# EAGLE schematic moustache_board (EAGLE 7.7.0)
SCALE: 1:1; SCHEMATIC_NAME: RECO0.16.018.01.00.00.E3; STUDENT: D. Palamarčuks; THESIS_SUPERVISOR: I. Galkins

## Sheet 1 of 2
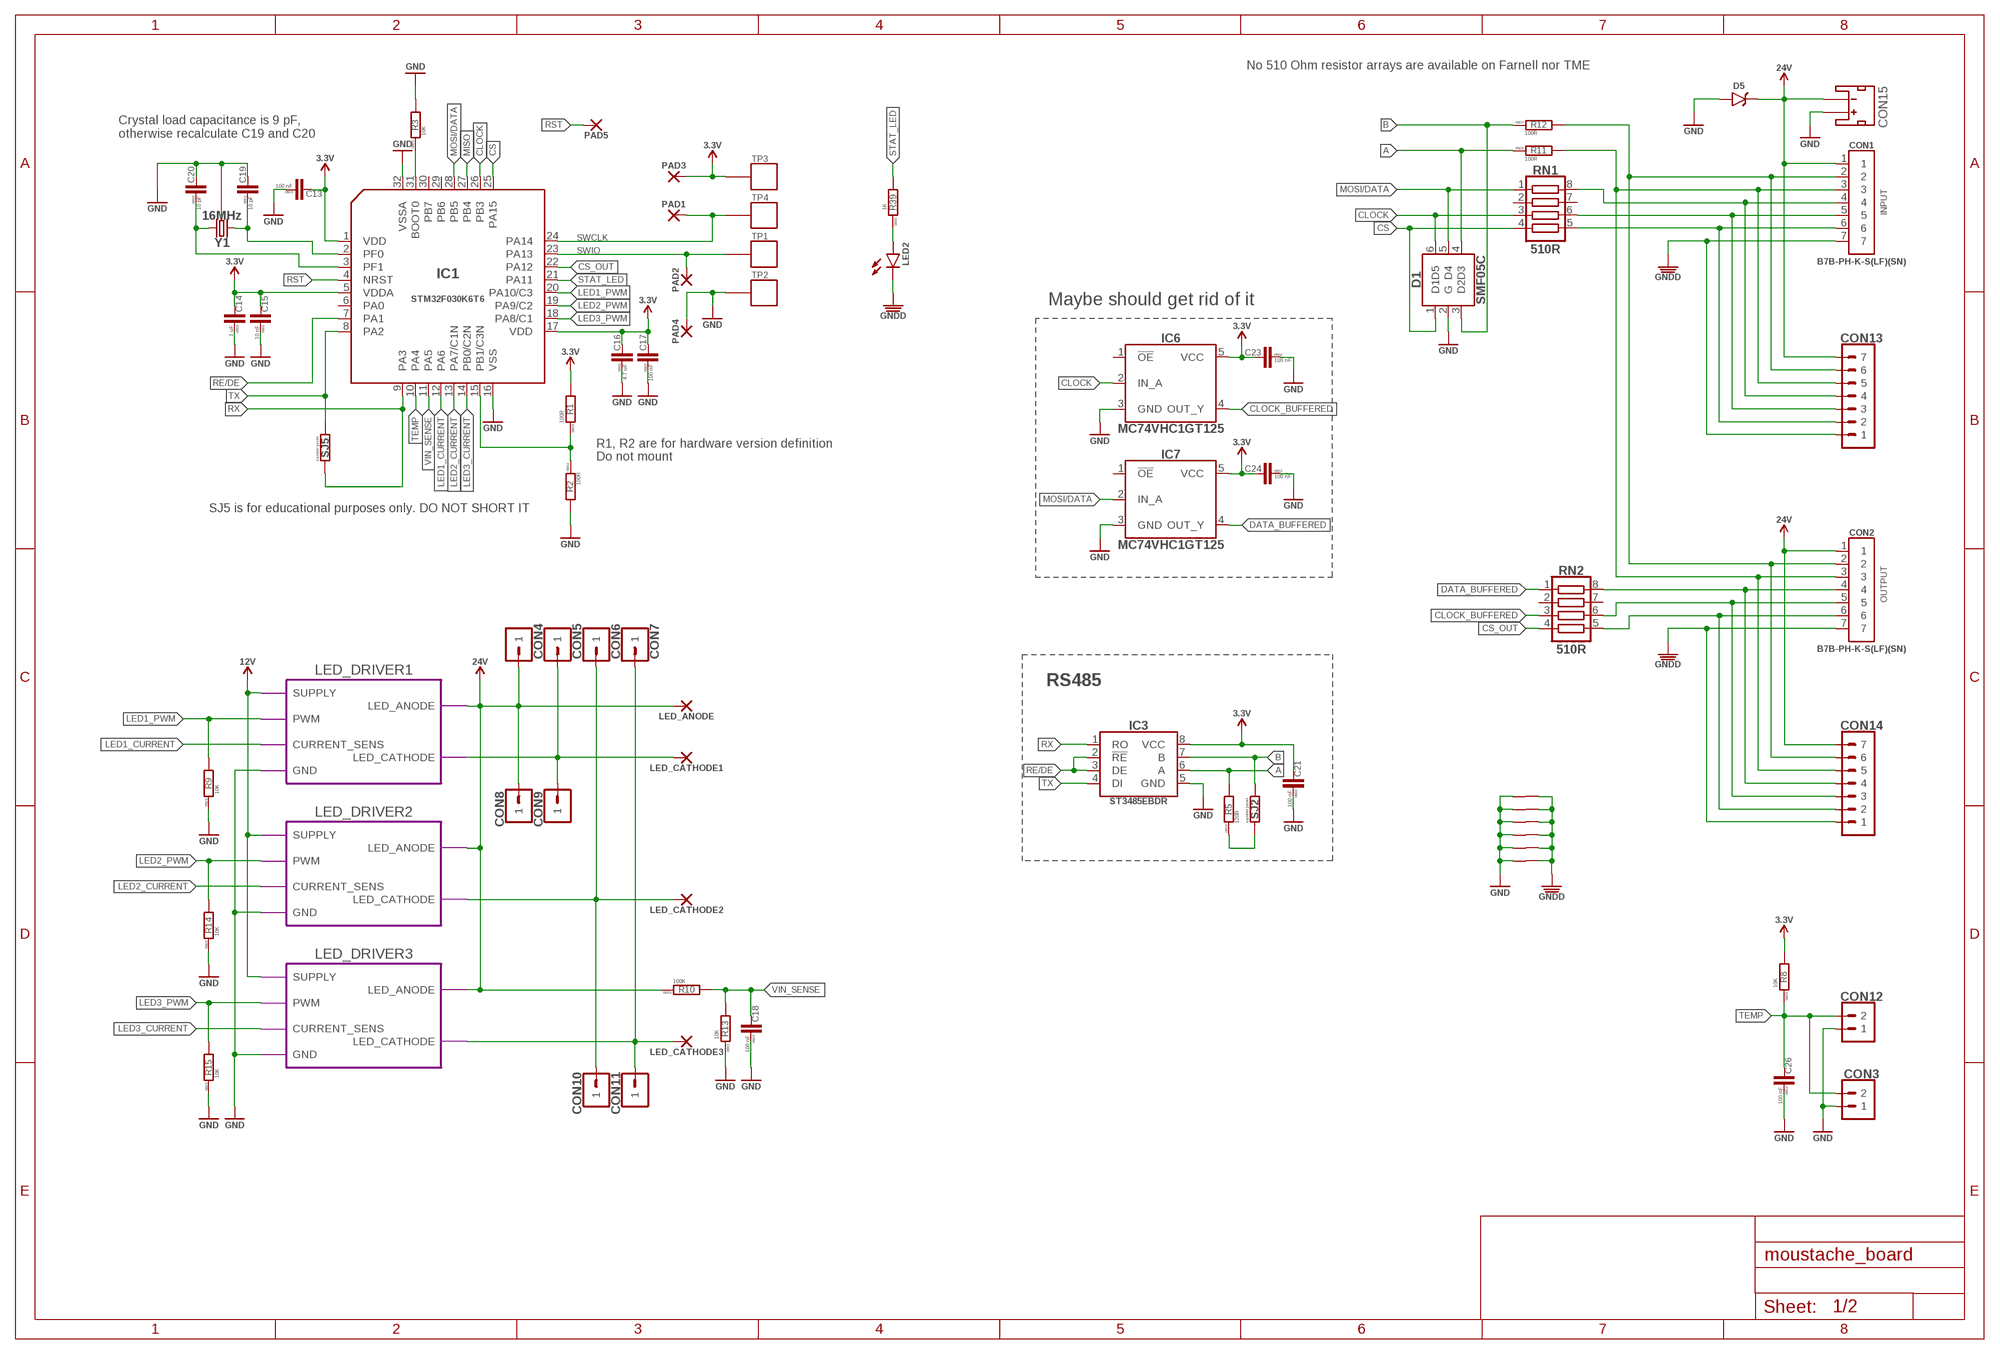
[diagram p0: schematic, sheet 1]

### Parts
C13  100 nF  C-0603  [C0603]
C14  1 uF  C-0603  [C0603]
C15  10 nF  C-0603  [C0603]
C16  4.7 uF  C-0603  [C0603]
C17  100 nF  C-0603  [C0603]
C18  100 nF  C-0603  [C0603]
C19  10 pF  C-0603  [C0603]
C20  10 pF  C-0603  [C0603]
C21  100 nF  C-0603  [C0603]
C23  100 nF  C-0603  [C0603]
C24  100 nF  C-0603  [C0603]
C26  100 nF  C-0603  [C0603]
CON1  B7B-PH-K-S-SIDE  [B7B-PH-K-S_SIDE]
CON2  B7B-PH-K-S-SIDE  [B7B-PH-K-S_SIDE]
CON3  PINHEAD_1X02-2.54  [1X02-PTH-2.54]
CON4  PINHEAD_1X01-2.54  [1X01-PTH-2.54]
CON5  PINHEAD_1X01-2.54  [1X01-PTH-2.54]
CON6  PINHEAD_1X01-2.54  [1X01-PTH-2.54]
CON7  PINHEAD_1X01-2.54  [1X01-PTH-2.54]
CON8  PINHEAD_1X01-2.54  [1X01-PTH-2.54]
CON9  PINHEAD_1X01-2.54  [1X01-PTH-2.54]
CON10  PINHEAD_1X01-2.54  [1X01-PTH-2.54]
CON11  PINHEAD_1X01-2.54  [1X01-PTH-2.54]
CON12  PINHEAD_1X02-2.54  [1X02-PTH-2.54]
CON13  PINHEAD_1X07-2  [1X07-PTH-2]
CON14  PINHEAD_1X07-2  [1X07-PTH-2]
CON15  B2B-PH-K-S  [B2B-PH-K-S_SIDE_MOUNT]
D1  SMF05C  [SC70_6L]
D5  TVS_DIODE-SMB  [SMB]
IC1  STM32F030K6TX-LQFP32(7X7)  [LQFP32-7X7]
IC3  ST3485SOIC8  [SOIC8]
IC6  MC74VHC1GT125  [SOT23-5]
IC7  MC74VHC1GT125  [SOT23-5]
LED2  LED-0603  [LED0603]
LED_ANODE  WIREPADSMD2.5-1.8  [PAD-2.5-1.8]
LED_CATHODE1  WIREPADSMD2.5-1.8  [PAD-2.5-1.8]
LED_CATHODE2  WIREPADSMD2.5-1.8  [PAD-2.5-1.8]
LED_CATHODE3  WIREPADSMD2.5-1.8  [PAD-2.5-1.8]
PAD1  WIREPADSMD2.5-1.8  [PAD-2.5-1.8]
PAD2  WIREPADSMD2.5-1.8  [PAD-2.5-1.8]
PAD3  WIREPADSMD2.5-1.8  [PAD-2.5-1.8]
PAD4  WIREPADSMD2.5-1.8  [PAD-2.5-1.8]
PAD5  WIREPADSMD2.5-1.8  [PAD-2.5-1.8]
R1  100R  R-0603  [R0603]
R2  100R  R-0603  [R0603]
R3  10K  R-0603  [R0603]
R5  120R  R-0603  [R0603]
R8  10K  R-0603  [R0603]
R9  10K  R-0603  [R0603]
R10  100K  R-0603  [R0603]
R11  100R  R-0603  [R0603]
R12  100R  R-0603  [R0603]
R13  10K  R-0603  [R0603]
R14  10K  R-0603  [R0603]
R15  10K  R-0603  [R0603]
R39  1K  R-0603  [R0603]
RN1  510R  RESISTOR_ARRAY  [CAT16-J4]
RN2  510R  RESISTOR_ARRAY  [CAT16-J4]
SJ2  SOLDER_JOINT  [RES_0]
SJ5  SOLDER_JOINT  [RES_0]
TP1  PAD.05  [PAD.05X.05]
TP2  PAD.05  [PAD.05X.05]
TP3  PAD.05  [PAD.05X.05]
TP4  PAD.05  [PAD.05X.05]
U$3  CONNECTION  [CONNECTION]
U$6  CONNECTION  [CONNECTION]
U$7  CONNECTION  [CONNECTION]
U$8  CONNECTION  [CONNECTION]
U$9  CONNECTION  [CONNECTION]
U$10  CONNECTION  [CONNECTION]
Y1  16MHz  CRYSTAL-3.2X2.5-4P  [OSCILLATOR-3.2X2.5]

### Module instances
LED_DRIVER1 = LED_DRIVER (part numbers offset by 100)
LED_DRIVER2 = LED_DRIVER (part numbers offset by 200)
LED_DRIVER3 = LED_DRIVER (part numbers offset by 300)

### Nets
A: D1.4(D3) IC3.6(A) R5.2 R11.1
B: D1.3(D2) IC3.7(B) R12.1 SJ2.1
CLOCK: D1.6(D5) IC1.26(PB3) IC6.2(IN_A) RN1.3
CLOCK_BUFFERED: IC6.4(OUT_Y) RN2.3
CS: D1.1(D1) IC1.25(PA15) RN1.4
CS_OUT: IC1.22(PA12) RN2.4
DATA_BUFFERED: IC7.4(OUT_Y) RN2.1
GND: C13.1 C14.1 C15.1 C16.1 C17.1 C18.1 C19.2 C20.2 C21.1 C23.1 C24.1 C26.1 CON3.1 CON12.1 CON15.1(+) D1.2(G) D5.A IC1.16(VSS) IC1.32(VSSA) IC3.5(GND) IC6.3(GND) IC7.3(GND) PAD4.P$1(P) R2.2 R3.2 R9.1 R13.1 R14.1 R15.1 TP2.P$1 U$3.P$2 U$6.P$2 U$7.P$2 U$8.P$2 U$9.P$2 U$10.P$2 Y1.2(GND) Y1.4(GND) ; port LED_DRIVER1.GND LED_DRIVER3.GND LED_DRIVER2.GND ; also sheet 2
GNDD: CON1.7 CON2.7 CON13.1 CON14.1 LED2.C U$3.P$1 U$6.P$1 U$7.P$1 U$8.P$1 U$9.P$1 U$10.P$1
LED1_CURRENT: IC1.12(PA6) ; port LED_DRIVER1.CURRENT_SENS
LED1_PWM: IC1.20(PA10/C3) R9.2 ; port LED_DRIVER1.PWM
LED2_CURRENT: IC1.13(PA7/C1N) ; port LED_DRIVER2.CURRENT_SENS
LED2_PWM: IC1.19(PA9/C2) R14.2 ; port LED_DRIVER2.PWM
LED3_CURRENT: IC1.14(PB0/C2N) ; port LED_DRIVER3.CURRENT_SENS
LED3_PWM: IC1.18(PA8/C1) R15.2 ; port LED_DRIVER3.PWM
MISO: IC1.27(PB4)
MOSI/DATA: D1.5(D4) IC1.28(PB5) IC7.2(IN_A) RN1.1
N$1: R5.1 SJ2.2
N$3: IC1.15(PB1/C3N) R1.1 R2.1
N$4: C19.1 IC1.2(PF0) Y1.1
N$6: IC1.31(BOOT0) R3.1
N$9: C20.1 IC1.3(PF1) Y1.3
N$10: CON5.1 CON9.1 LED_CATHODE1.P$1(P) ; port LED_DRIVER1.LED_CATHODE
N$11: CON1.4 CON13.4 RN1.8
N$12: CON1.5 CON13.3 RN1.6
N$13: CON1.6 CON13.2 RN1.5
N$14: CON2.4 CON14.4 RN2.8
N$15: CON2.5 CON14.3 RN2.6
N$19: CON2.6 CON14.2 RN2.5
N$21: CON6.1 CON10.1 LED_CATHODE2.P$1(P) ; port LED_DRIVER2.LED_CATHODE
N$22: LED2.A R39.1
N$23: CON7.1 CON11.1 LED_CATHODE3.P$1(P) ; port LED_DRIVER3.LED_CATHODE
RE/DE: IC1.7(PA1) IC3.2(!RE) IC3.3(DE)
RS485_A: CON1.2 CON2.2 CON13.6 CON14.6 R12.2
RS485_B: CON1.3 CON2.3 CON13.5 CON14.5 R11.2
RST: IC1.4(NRST) PAD5.P$1(P)
RX: IC1.9(PA3) IC3.1(RO) SJ5.2
STAT_LED: IC1.21(PA11) R39.2
SWCLK: IC1.24(PA14) PAD1.P$1(P) TP4.P$1
SWIO: IC1.23(PA13) PAD2.P$1(P) TP1.P$1
TEMP: C26.2 CON3.2 CON12.2 IC1.10(PA4) R8.1
TX: IC1.8(PA2) IC3.4(DI) SJ5.1
VDD_3V3: C13.2 C14.2 C15.2 C16.2 C17.2 C21.2 C23.2 C24.2 IC1.1(VDD) IC1.5(VDDA) IC1.17(VDD) IC3.8(VCC) IC6.5(VCC) IC7.5(VCC) PAD3.P$1(P) R1.2 R8.2 TP3.P$1 ; supply symbol labelled 3.3V ; also sheet 2
VDD_12V: port LED_DRIVER2.SUPPLY LED_DRIVER1.SUPPLY LED_DRIVER3.SUPPLY ; supply symbol labelled 12V ; also sheet 2
VDD_24V: CON1.1 CON2.1 CON4.1 CON8.1 CON13.7 CON14.7 CON15.2(-) D5.C LED_ANODE.P$1(P) R10.1 ; port LED_DRIVER1.LED_ANODE LED_DRIVER3.LED_ANODE LED_DRIVER2.LED_ANODE ; supply symbol labelled 24V ; also sheet 2
VIN_SENSE: C18.2 IC1.11(PA5) R10.2 R13.2
Unconnected: IC1.6(PA0) IC1.29(PB6) IC1.30(PB7) IC6.1(!OE) IC7.1(!OE) RN1.2 RN1.7 RN2.2 RN2.7

### Notes on the sheet
- No 510 Ohm resistor arrays are available on Farnell nor TME
- Crystal load capacitance is 9 pF,
  otherwise recalculate C19 and C20
- INPUT
- Maybe should get rid of it
- R1, R2 are for hardware version definition
- Do not mount
- SJ5 is for educational purposes only. DO NOT SHORT IT
- OUTPUT
- RS485

## Sheet 2 of 2: DC-DC converter
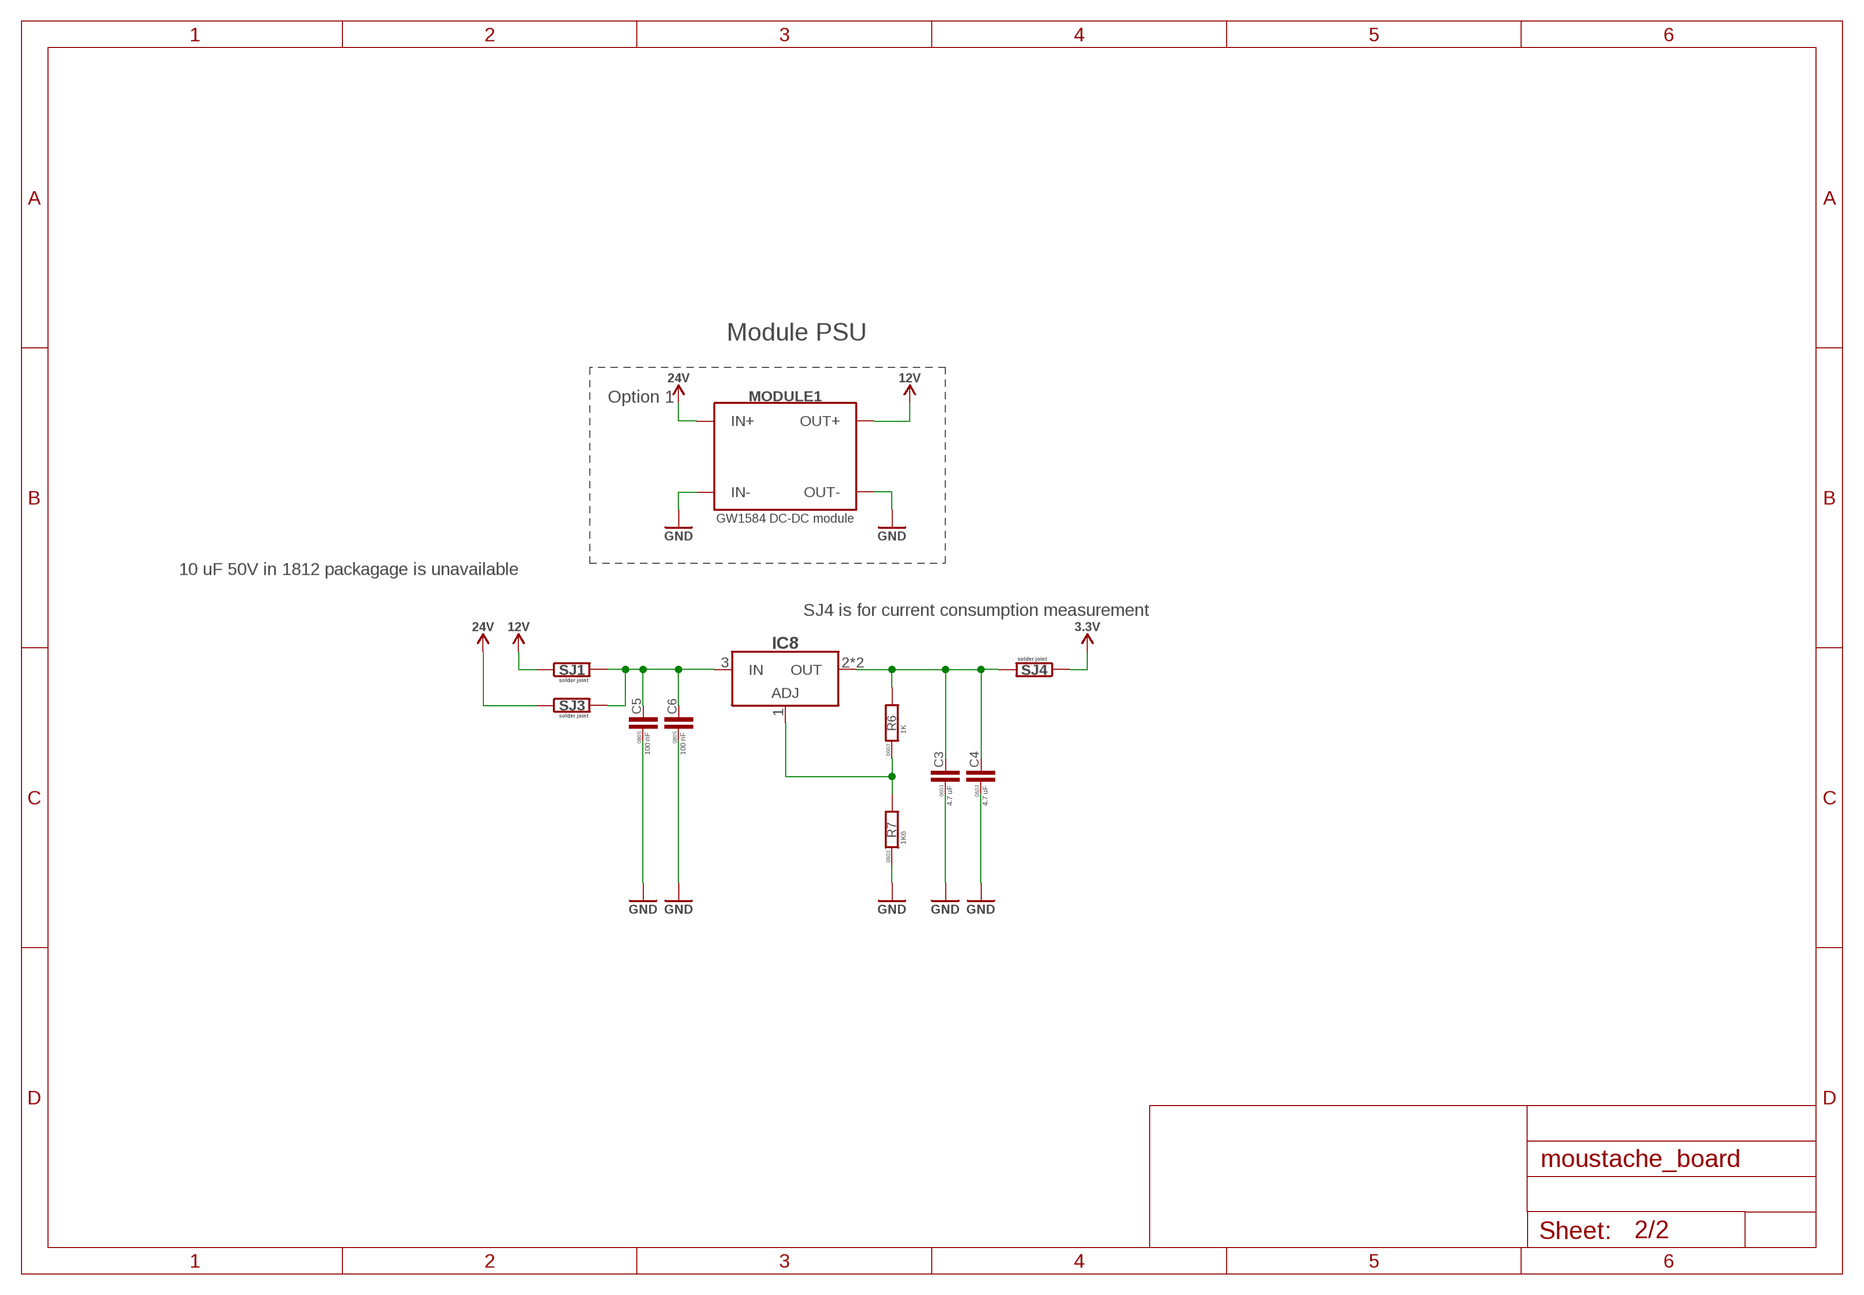
[diagram p1: schematic, sheet 2]

### Parts
C3  4.7 uF  C-0603  [C0603]
C4  4.7 uF  C-0603  [C0603]
C5  100 nF  C-0805  [C0805]
C6  100 nF  C-0805  [C0805]
IC8  LM317  [SOT223]
MODULE1  GW1584  [GW1584]
R6  1K  R-0603  [R0603]
R7  1K6  R-0603  [R0603]
SJ1  SOLDER_JOINT  [RES_0]
SJ3  SOLDER_JOINT  [RES_0]
SJ4  SOLDER_JOINT  [RES_0]

### Nets
GND: C3.1 C4.1 C5.1 C6.1 MODULE1.IN-@1(IN-) MODULE1.IN-@2(IN-) MODULE1.OUT-@1(OUT-) MODULE1.OUT-@2(OUT-) R7.1 ; also sheet 1
N$2: C3.2 C4.2 IC8.2(OUT) IC8.4(OUT) R6.2 SJ4.2
N$5: C5.2 C6.2 IC8.3(IN) SJ1.2 SJ3.2
N$20: IC8.1(ADJ) R6.1 R7.2
VDD_3V3: SJ4.1 ; supply symbol labelled 3.3V ; also sheet 1
VDD_12V: MODULE1.OUT+@1(OUT+) MODULE1.OUT+@2(OUT+) SJ1.1 ; supply symbol labelled 12V ; also sheet 1
VDD_24V: MODULE1.IN+@1(IN+) MODULE1.IN+@2(IN+) SJ3.1 ; supply symbol labelled 24V ; also sheet 1

### Notes on the sheet
- Module PSU
- Option 1
- 10 uF 50V in 1812 packagage is unavailable
- SJ4 is for current consumption measurement

## Library data of the parts
C3 C4 C16 = rc:C; FARNELL#: 2496930; PACKAGE: 0603; TME#: GRM188R60J475KE19D
C5 C6 = rc:C; FARNELL#: 2496834; PACKAGE: 0805; TME#: GRM188R71H104KA93D
C13 C17 C18 C21 C23 C24 C26 = rc:C; FARNELL#: 2496834; PACKAGE: 0603; TME#: GRM188R71H104KA93D
C14 = rc:C; FARNELL#: 2496917; PACKAGE: 0603; TME#: GRM188R61C105KA93D
C15 = rc:C; FARNELL#: 2496827; PACKAGE: 0603; TME#: C0603C103K3RAC
C19 C20 = rc:C; FARNELL#: 1414601; PACKAGE: 0603; TME#: GRM1885C1H100JA01D
CON1 CON2 = pixel_masterlib:B7B-PH-K-S: 7 Positions Header Connector 2.00mm, Through Hole, Side SMD; CHIPDIP#: 9000325603; DIGIKEY#: 455-1709-ND; FARNELL#: 9491864; MANF#: B7B-PH-K-S(LF)(SN); TME#: B7B-PH-K-S
CON3 CON12 = pinhead:PINHEAD_1X02: pinheader 2P
CON4-CON11 = pinhead:PINHEAD_1X01: pinheader 1P
CON13 CON14 = pinhead:PINHEAD_1X07: pinheader 7P
CON15 = led_matrix_master_lib:B2B-PH-K-S: CONN HEADER PH TOP 2POS 2MM
D1 = pixel_masterlib:SMF05C; CHIPDIP#: 9000048448; DIGIKEY#: SMF05CCT-ND; FARNELL#: 2059033; MANF: Semtech Corporation; MANF#: SMF05C.TCT; TME#: SMF05CT1G
D5 = pixel_masterlib:TVS_DIODE; CHIPDIP#: 8023193826; DIGIKEY#: 497-15658-2-ND; FARNELL#: 1749366; MANF: STMicroelectronics; MANF#: SMBJ26CA; TME#: SMBJ26CA-LF
IC1 = pixel_masterlib:STM32F030K6TX: MCU 32BIT 32KB FLASH 32LQFP; CHIPDIP#: 9000250493; DIGIKEY#: 497-14046-ND; FARNELL#: 2432085; MANF: STMicroelectronics; MANF#: STM32F030K6T6; TME#: STM32F030K6T6
IC3 = pixel_masterlib:ST3485: IC TXRX 3.3V RS485/422 8 SOIC; CHIPDIP#: 9000220421; DIGIKEY#: 497-2080-1-ND; FARNELL#: 2253266; MANF: STMicroelectronics; MANF#: ST3485EBDR; TME#: ST3485EBD
IC6 IC7 = pixel_masterlib:MC74VHC1GT125: Buffer, Non-Inverting 1 Element 1 Bit per Element Push-Pull Output 5-TSOP; CHIPDIP#: 9000014391; DIGIKEY#: MC74VHC1GT125DT1GOSDKR-ND; FARNELL#: 2101847; MANF: ON Semiconductor; MANF#: MC74VHC1GT125
IC8 = pixel_masterlib:LM317: Linear Voltage Regulator IC Positive Adjustable 1 Output 1.2 V ~ 37 V 500mA SOT-223; CHIPDIP#: LM317DCY; DIGIKEY#: 296-23224-5-ND; FARNELL#: 2112605; MANF: Texas Instruments; MANF#: LM317MSTT3G; TME#: LM317DCY
LED2 = rc:LED: SMD LED; CHIPDIP#: 8598509892; COLOR: GREEN; DIGIKEY#: 160-1446-1-ND; FARNELL#: 2293494; MANF: Lite-On Inc; MANF#: LTST-C191KGKT; TME#: LTST-C191KGKT
LED_ANODE LED_CATHODE1-LED_CATHODE3 PAD1-PAD5 = wirepad:WIREPAD: Wire PAD connect wire on PCB; BOM: EXCLUDE
MODULE1 = pixel_masterlib:GW1584: THIS http://mysku.ru/blog/aliexpress/35938.html http://ru.aliexpress.com/item/New-Mini-Converter-Adjustable-DC-DC-Step-down-Power-Supply-Module-replace-LM2596/32411413046.html?spm=2114.30010708.3.314.AhmzLw&s=p&ws_ab_test=searchweb201556_6,searchweb201602_5_10017_10010_10011_10018_10019_10036_10035_10034_301_507_10033_10032_10020_10001_10002_10005_10006_10021_10003_10022_10004_401_10009_10007_10008_2030013,searchweb201603_9&btsid=8a54b1af-cc82-4f8d-a784-d3b67147a089
R1 R2 = rc:R; ASSY: DO NOT MOUNT; PACKAGE: 0603
R3 R8 R9 R13-R15 = rc:R; FARNELL#: 2008341; PACKAGE: 0603; TME#: RC0603FR-0710K
R5 = rc:R; FARNELL#: 2303067; PACKAGE: 0603; TME#: CRCW0603120RFKTABC
R6 R39 = rc:R; FARNELL#: 2303145; PACKAGE: 0603; TME#: RC0603FR-071K
R7 = rc:R; FARNELL#: 2303159; PACKAGE: 0603; TME#: RC0603FR-071K6
R10 = rc:R; FARNELL#: 2303232; PACKAGE: 0603; TME#: RC0603FR-07100K
R11 R12 = rc:R; FARNELL#: 2303059; PACKAGE: 0603; TME#: RC0603FR-07100R
RN1 RN2 = pixel_masterlib:RESISTOR_ARRAY: Chip Resistor Array 4 Single Resistor; CHIPDIP#: 9000044911; DIGIKEY#: CAT16-511J4LF-ND; FARNELL#: 2321730; MANF: Bourns Inc; MANF#: CAT16-511J4LF
SJ1-SJ5 = eth_conv_master_lib:SOLDER_JOINT; BOM: EXCLUDE
TP1-TP4 = misc:PAD: Test pad This footprint includes three classes: The actual test pads, a pogo-pin footprint to mount the pogo-pin as through-hole part and a hole footprint which allows the head of the pogo-pin to pass through (do NOT use the hole to mount the pogo-pin). In a typical test setup, the stack would consist of three PCBs: The actual PCB under testing with a test pad on the bottom, then a second PCB with the hole for the pogo-pin head where the PCB under testing is pressed on and a third PCB at 30 mm / 1.2" distance with the pogo-pin footprints. The pogo-pins are soldered to the last PCB. To create the stack, copy the board under testing and exchange the footprints - this way the correct positioning is ensured.; BOM: EXCLUDE; PARTNO: *
U$3 U$6-U$10 = usb2can_master_lib:CONNECTION; BOM: EXCLUDE
Y1 = crystals:CRYSTAL: Smd Crystal; CHIPDIP#: 8596067027; DIGIKEY#: SER4069CT-ND; FARNELL#: 1712841; MANF: Epson; MANF#: X1E0000210013 TSX-3225 16 MHZ 9.0PF

## Module LED_DRIVER
Ports: GND(pwr) PWM(in) CURRENT_SENS(out) LED_ANODE(pwr) LED_CATHODE(pwr) SUPPLY(pwr)
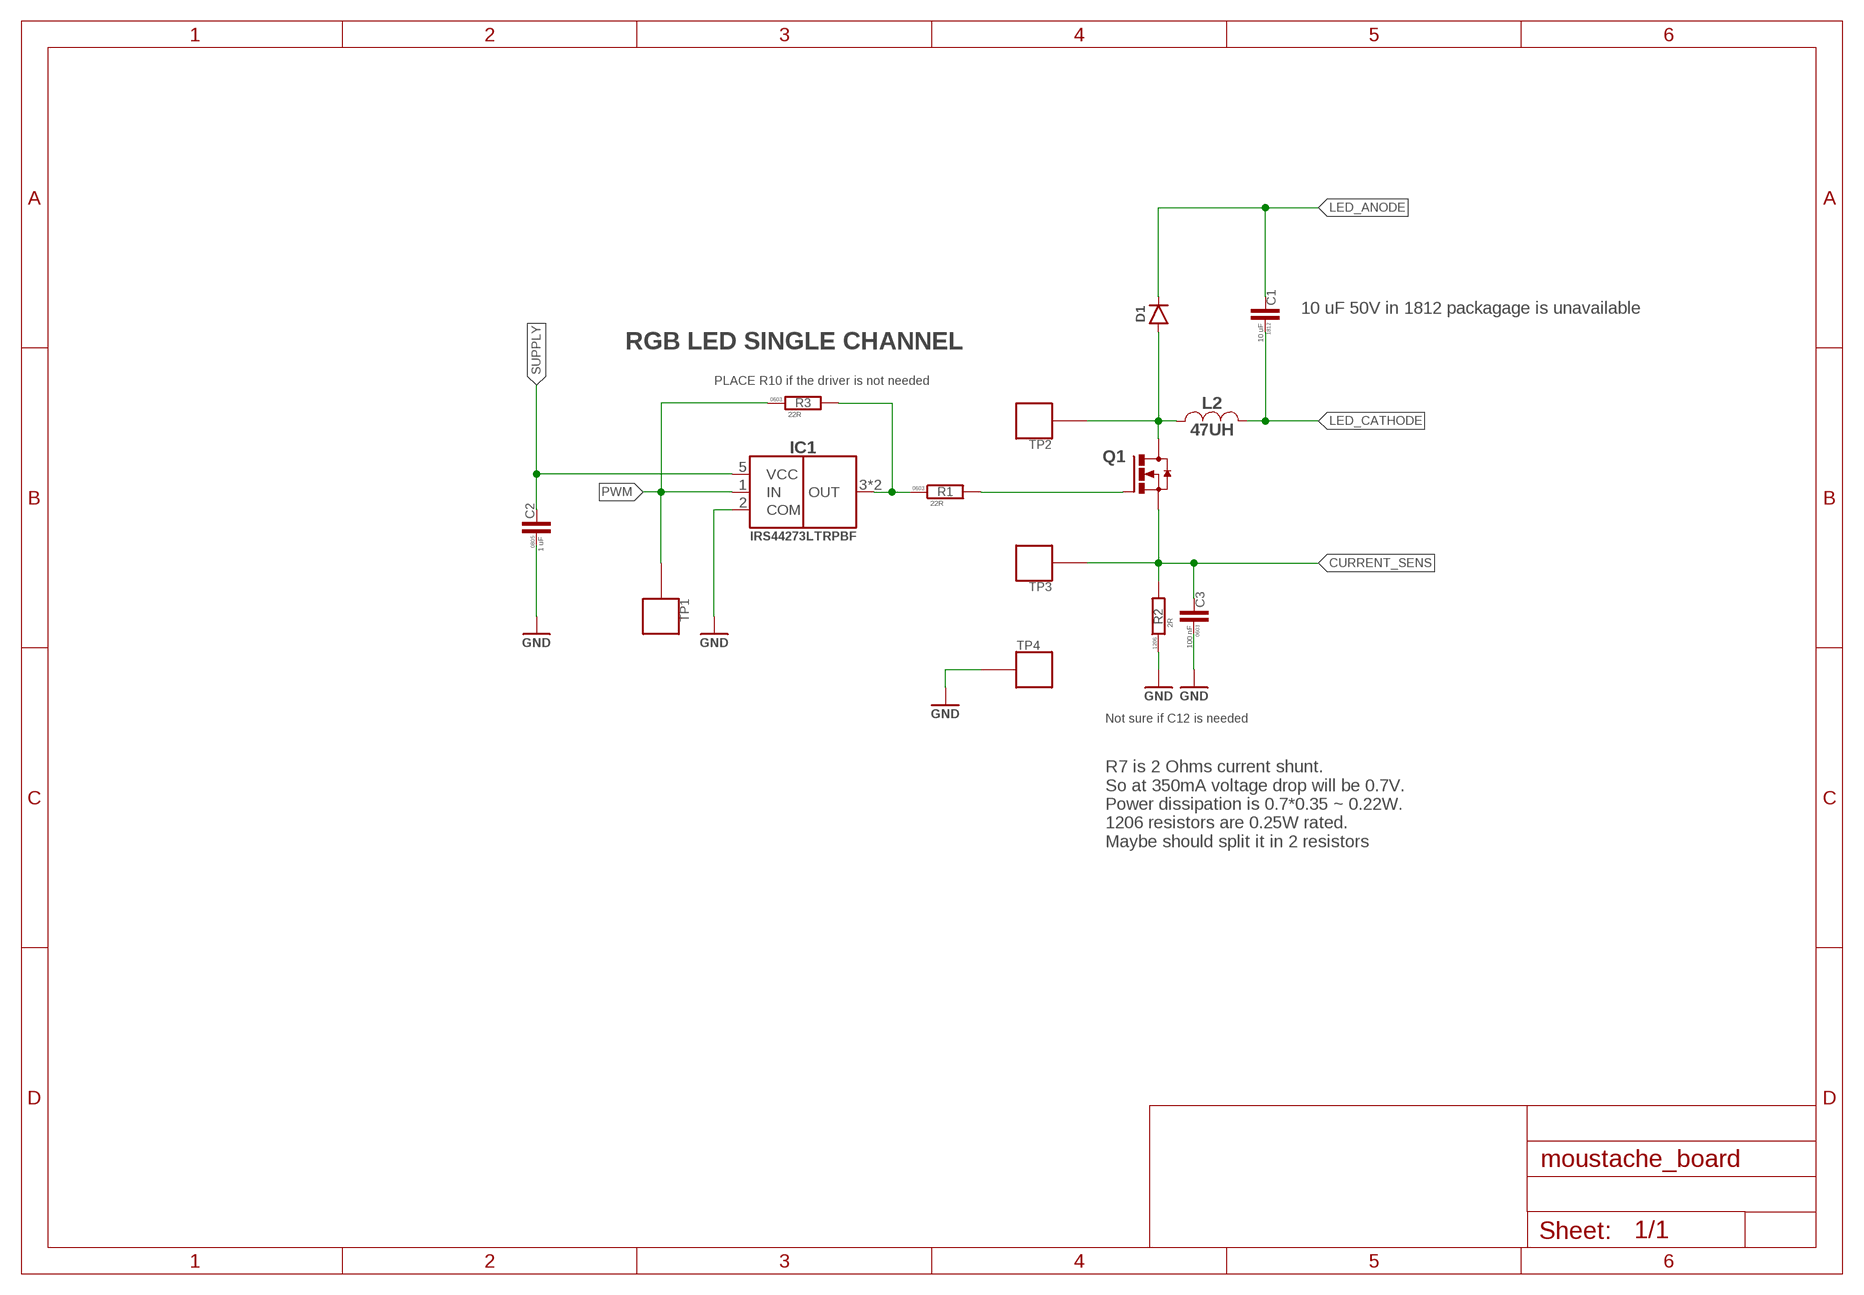
[diagram p2: schematic, module LED_DRIVER, sheet 1]

### Parts
C1  10 uF  C-1812  [C1812]
C2  1 uF  C-0805  [C0805]
C3  100 nF  C-0603  [C0603]
D1  DIODE-SOD123  [SOD123]
IC1  IRS44273L  [SOT23-5]
L2  47UH  INDUCTOR-470KL-SDR0805  [SDR0805]
Q1  N-FET-SOT23  [SOT23-3]
R1  22R  R-0603  [R0603]
R2  2R  R-R1206  [R1206]
R3  22R  R-0603  [R0603]
TP1  PAD.05  [PAD.05X.05]
TP2  PAD.05  [PAD.05X.05]
TP3  PAD.05  [PAD.05X.05]
TP4  PAD.05  [PAD.05X.05]

### Nets
CURRENT_SENS: C3.2 Q1.2(S) R2.P$2 TP3.P$1
GND: C2.1 C3.1 IC1.2(COM) R2.P$1 TP4.P$1
LED_ANODE: C1.P$2 D1.C
LED_CATHODE: C1.P$1 L2.2
N$2: D1.A L2.1 Q1.3(D) TP2.P$1
N$3: IC1.3(OUT) IC1.4(OUT) R1.1 R3.2
N$7: Q1.1(G) R1.2
PWM: IC1.1(IN) R3.1 TP1.P$1
SUPPLY: C2.2 IC1.5(VCC)

### Notes on the sheet
- 10 uF 50V in 1812 packagage is unavailable
- RGB LED SINGLE CHANNEL
- PLACE R10 if the driver is not needed
- Not sure if C12 is needed
- R7 is 2 Ohms current shunt. 
  So at 350mA voltage drop will be 0.7V. 
  Power dissipation is 0.7*0.35 ~ 0.22W. 
  1206 resistors are 0.25W rated. 
  Maybe should split it in 2 resistors

### Library data of the parts
C1 = rc:C; FARNELL#: 2449143; PACKAGE: 1812; TME#: CL32B106KBJNNNE
C2 = rc:C; FARNELL#: 1735541; PACKAGE: 0805; TME#: GRM21BR71H105KA12L
C3 = rc:C; FARNELL#: 2496834; PACKAGE: 0603; TME#: GRM188R71H104KA93D
D1 = pixel_masterlib:DIODE; CHIPDIP#: MBRS1100T3G; DIGIKEY#: MBRS1100T3GOSCT-ND; FARNELL#: 9555862; MANF: ON Semiconductor; MANF#: MBRS1100T3G; TME#: MBRS1100T3G
IC1 = pixel_masterlib:IRS44273L: Low-Side Gate Driver IC Non-Inverting SOT-23-5; CHIPDIP#: 9000204261; DIGIKEY#: IRS44273LTRPBFTR-ND; FARNELL#: 2580779; MANF: Infineon Technologies; MANF#: IRS44273LTRPBF; TME#: IRS44273LTRPBF
L2 = power_inductors:INDUCTOR: Unshielded Wirewound Inductor; CHIPDIP#: 8980699057; DIGIKEY#: SDR0805-470KLCT-ND; FARNELL#: 1828030; MANF: Bourns Inc; MANF#: SDR0805-470KL
Q1 = pixel_masterlib:N-FET; CHIPDIP#: 9000095041; DIGIKEY#: IRLML0040TRPBFCT-ND; FARNELL#: 1831088; MANF: Infineon Technologies; MANF#: IRLML0040TRPBF; TME#: IRLML0040TRPBF
R1 R3 = rc:R; FARNELL#: 2302996; PACKAGE: 0603; TME#: CRCW060322R0FKEA
R2 = rc:R; FARNELL#: 2502621; PACKAGE: 1206; TME#: RC1206FR-072R
TP1-TP4 = pixhawk2:PAD: Test pad This footprint includes three classes: The actual test pads, a pogo-pin footprint to mount the pogo-pin as through-hole part and a hole footprint which allows the head of the pogo-pin to pass through (do NOT use the hole to mount the pogo-pin). In a typical test setup, the stack would consist of three PCBs: The actual PCB under testing with a test pad on the bottom, then a second PCB with the hole for the pogo-pin head where the PCB under testing is pressed on and a third PCB at 30 mm / 1.2" distance with the pogo-pin footprints. The pogo-pins are soldered to the last PCB. To create the stack, copy the board under testing and exchange the footprints - this way the correct positioning is ensured.; BOM: EXCLUDE; PARTNO: *

## Net classes
4 USBpair: width 0.152 mm, drill 0.305 mm, clearance 0.152 mm